# EAGLE design AudioJackIO (EAGLE 9.6.1)
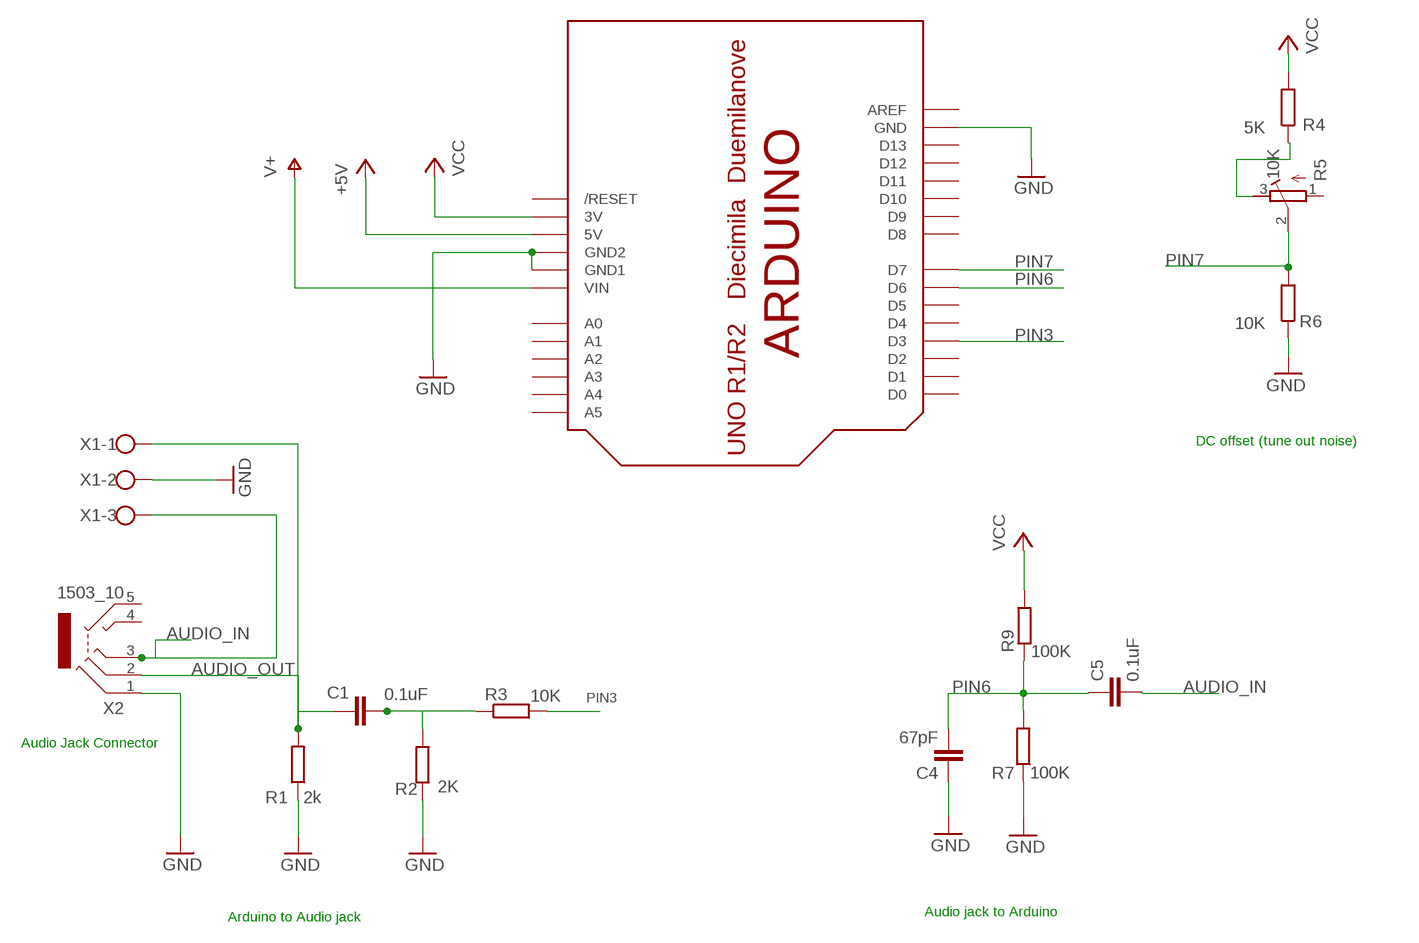
[diagram p0: schematic, sheet 1]

## Parts
C1  0.1uF  C-EU025-025X050  [C025-025X050]
C4  67pF  C-EU025-025X050  [C025-025X050]
C5  0.1uF  C-EU025-025X050  [C025-025X050]
R1  2k  R-EU_0204/7  [0204/7]
R2  2K  R-EU_0204/7  [0204/7]
R3  10K  R-EU_0204/7  [0204/7]
R4  5K  R-EU_0204/7  [0204/7]
R5  10K  R-TRIMM64Y  [RTRIM64Y]
R6  10K  R-EU_0204/7  [0204/7]
R7  100K  R-EU_0204/7  [0204/7]
R9  100K  R-EU_0204/7  [0204/7]
U$1  ARDUINO-BPLACE  [ARDUINO-BPLACE]
X1  W237-103  [W237-103]
X2  1503_10  [1503_10]

## Nets
+5V [POWER]: U$1.5V
AUDIO_IN [Signal]: C5.2 X1.3 X2.3
AUDIO_OUT [Signal]: C1.1 R1.2 X1.1 X2.2
GND [POWER]: C4.1 R1.1 R2.2 R6.1 R7.1 U$1.GND U$1.GND1 U$1.GND2 X1.2 X2.1
N$1 [Signal]: C1.2 R2.1 R3.1
N$3 [Signal]: R4.1 R5.3(E)
PIN3 [Signal]: R3.2 U$1.D3
PIN6 [Signal]: C4.2 C5.1 R7.2 R9.1 U$1.D6
PIN7 [Signal]: R5.2(S) R6.2 U$1.D7
V+ [POWER]: U$1.VIN
VCC [POWER]: R4.2 R9.2 U$1.3V
Unconnected: R5.1(A) U$1.A0 U$1.A1 U$1.A2 U$1.A3 U$1.A4 U$1.A5 U$1.AREF U$1.D0 U$1.D1 U$1.D2 U$1.D4 U$1.D5 U$1.D8 U$1.D9 U$1.D10 U$1.D11 U$1.D12 U$1.D13 U$1.RESET(/RESET) X2.4 X2.5

## Notes on the sheet
- DC offset (tune out noise)
- Audio Jack Connector
- Audio jack to Arduino
- Arduino to Audio jack

## Library data of the parts
C1 C4 C5 = rcl:C-EU: CAPACITOR, European symbol; SPICEPREFIX: C
R1-R4 R6 R7 R9 = rcl:R-EU_: RESISTOR, European symbol; SPICEPREFIX: R
R5 = rcl:R-TRIMM: Trimm resistor; SPICEMODEL: X; SPICEPREFIXL: POT
U$1 = adafruit:ARDUINO: Arduino Diecimila/Duemilanove Make a shield with ease, this package has all the named pins as well as the two mounting drill holes and an outline of the USB and DC power connector. The outline is on the DIMENSION layer, so if your board house uses it they will cut the outline to match. http://www.ladyada.net/library/pcb/eaglelibrary.html
X1 = con-wago-500:W237-103: WAGO SCREW CLAMP; MPN: 237-103; OC_FARNELL: unknown; OC_NEWARK: 18M7116
X2 = con-lumberg:1503_10: Jack connectors according to JISC 6560, 3.5 mm Klinkeneinbaukupplung, 3,5 mm, 4-polig/stereo, abgewinkelte Ausführung Source: http://www.lumberg.de/Produkte/PDFs/1503_10.pdf; OC_FARNELL: 1308868; OC_NEWARK: unknown

## Net classes
1 POWER: width 1.27 mm
2 Signal: width 0.889 mm

## Board
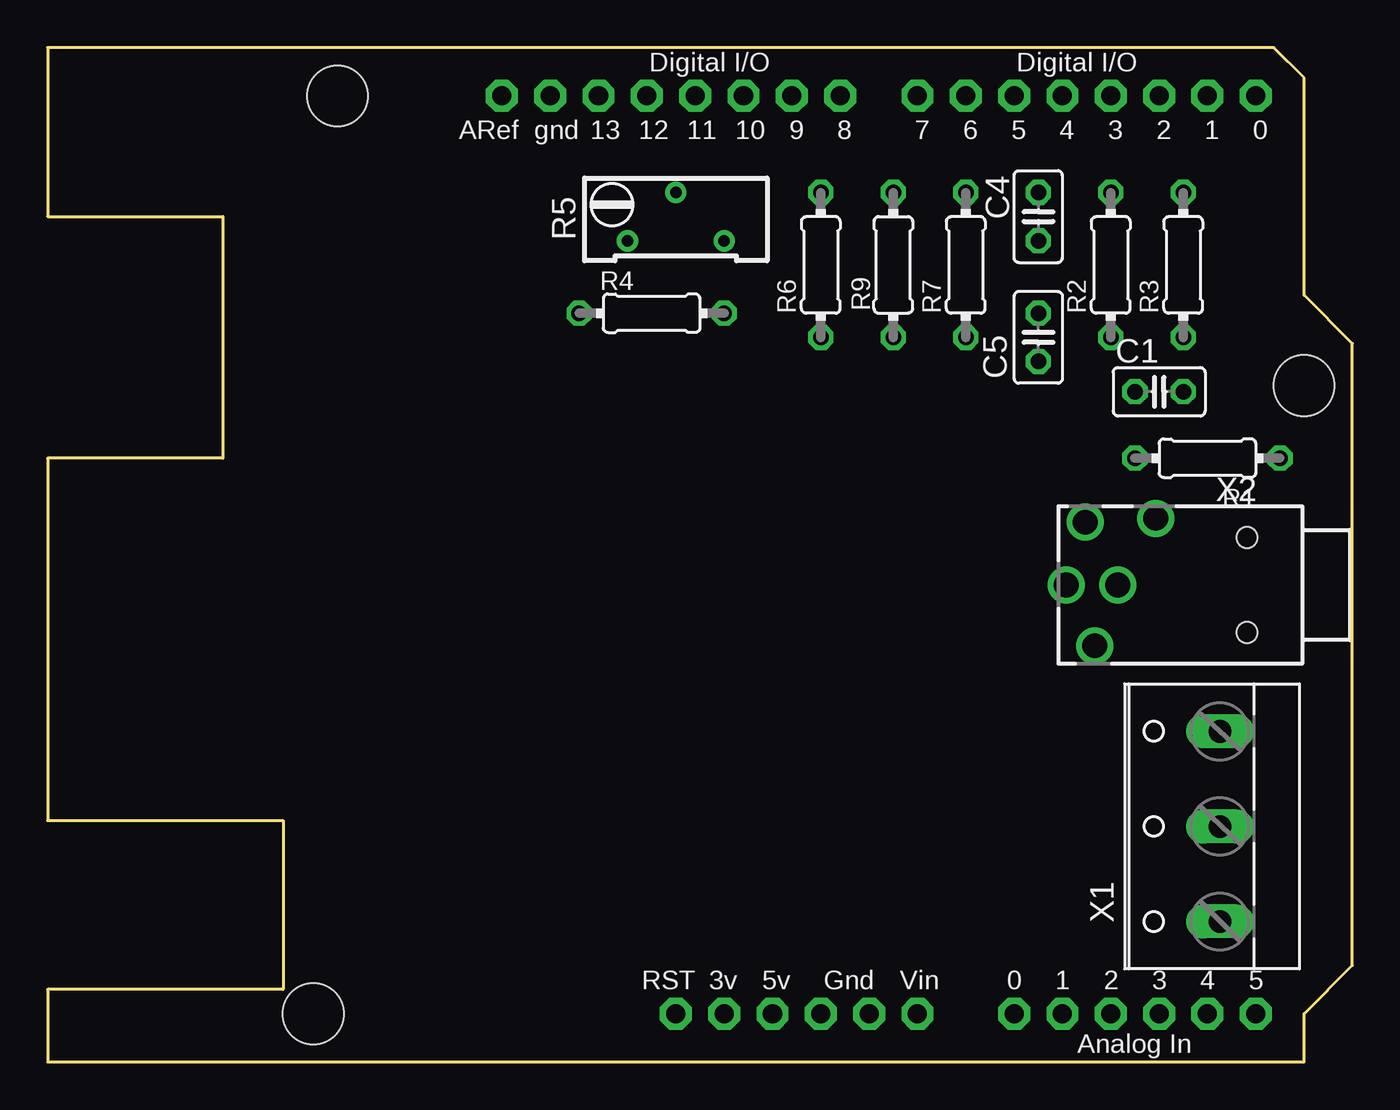
[diagram p1: board, top side]
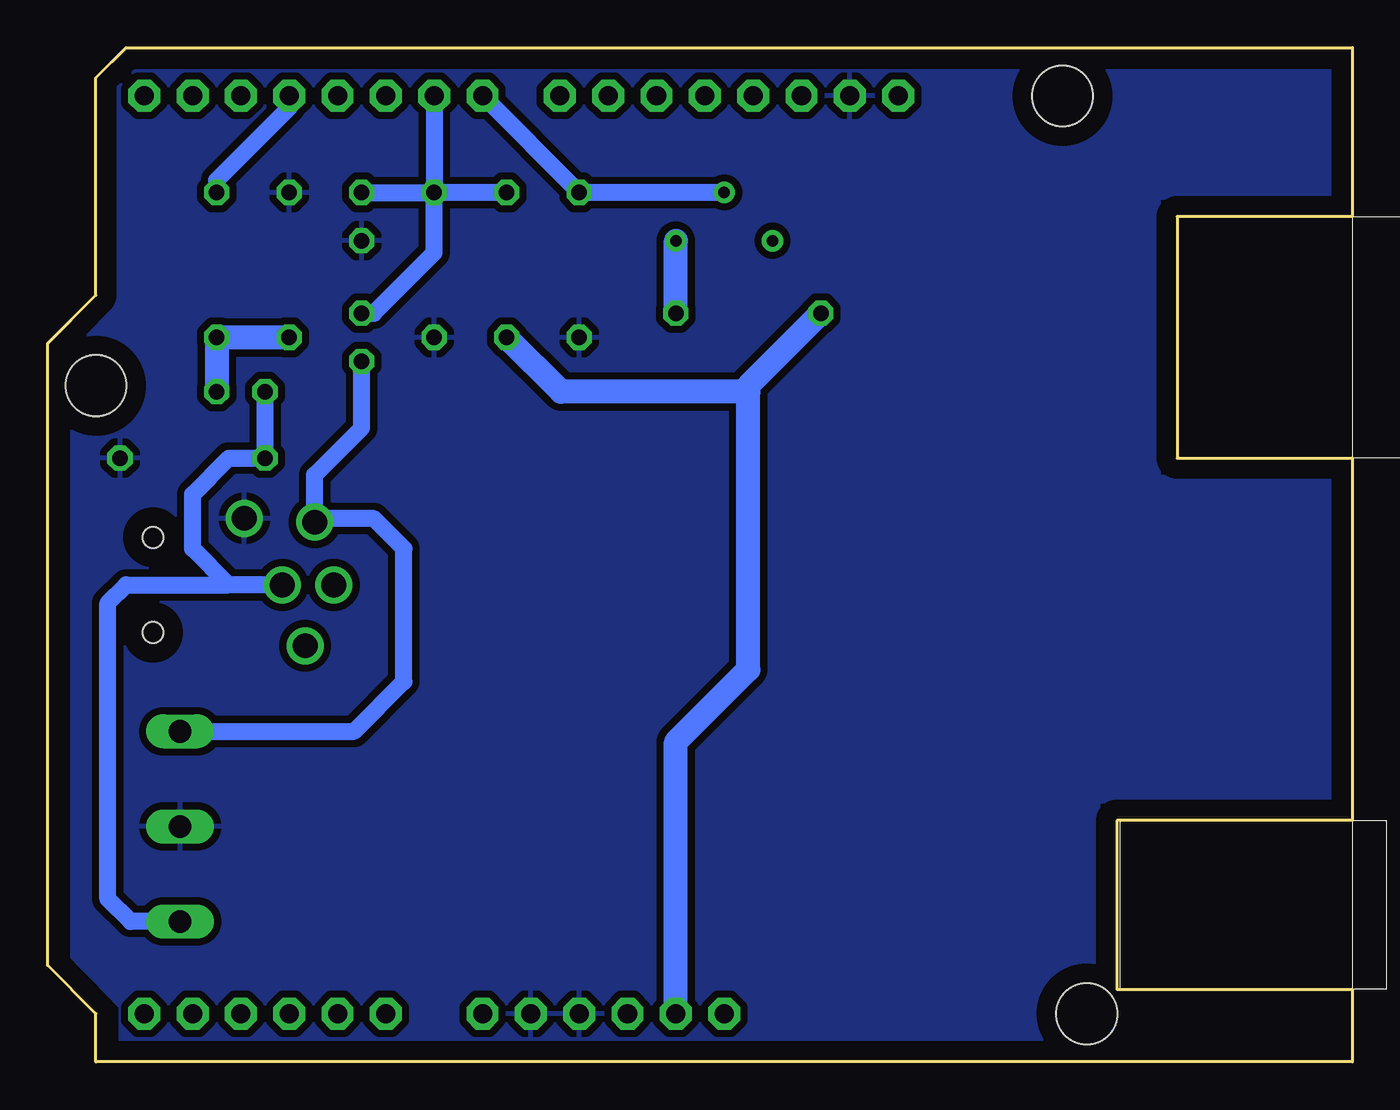
[diagram p2: board, bottom side, seen from below]

Size 68.58 x 53.34 mm. Coordinates in mm from the lower left corner, seen from the top.
Outline: 0,53.34 0,44.45 9.21,44.45 9.21,31.75 0,31.75 0,12.7 12.38,12.7 12.38,3.81 0,3.81 0,0 66.04,0 66.04,2.54 68.58,5.08 68.58,37.78 66.04,40.32 66.04,51.75 64.45,53.34 0,53.34
Copper layers (1*16): Top 0.035mm / dielectric 1.5mm / Bottom 0.035mm
Design rules "default *": minimum track width 15mil, minimum drill 0.35mm, track to track 15mil, track to pad 15mil, pad to pad 15mil, via to via 15mil, smd to smd 15mil, copper to edge 40mil, drill to drill 6mil, minimum pad ring 10mil, minimum via ring 8mil, stop-mask expansion 4mil, vias tented up to drill 0mil, thermal gap 15mil

### Footprints (pad centres in the part's own frame; a part is rotated, then mirrored left to right if it is on the bottom)
C025-025X050 = drill 0.813 octagon: 1 -1.27,0; 2 1.27,0
0204/7 = drill 0.813 octagon: 1 -3.81,0; 2 3.81,0
RTRIM64Y = drill 0.61: 1 0,-2.54; 2 -2.54,0; 3 0,2.54
ARDUINO-BPLACE = drill 1 pad 1.676 octagon: 3V 35.56,2.54; 5V 38.1,2.54; A0 50.8,2.54; A1 53.34,2.54; A2 55.88,2.54; A3 58.42,2.54; A4 60.96,2.54; A5 63.5,2.54; AREF 23.876,50.8; D0 63.5,50.8; D1 60.96,50.8; D2 58.42,50.8; D3 55.88,50.8; D4 53.34,50.8; D5 50.8,50.8; D6 48.26,50.8; D7 45.72,50.8; D8 41.656,50.8; D9 39.116,50.8; D10 36.576,50.8; D11 34.036,50.8; D12 31.496,50.8; D13 28.956,50.8; GND 26.416,50.8; GND1 43.18,2.54; GND2 40.64,2.54; RESET 33.02,2.54; VIN 45.72,2.54 | hole 3.2: 15.24,50.8; 66.04,35.56; 13.97,2.54
W237-103 = drill 1.194 long: 1 -5,-1.29; 2 0,-1.29; 3 5,-1.29
1503_10 = drill 1.3 pad 1.9: 1 -3.5,-7.8; 2 0,-9.8; 3 -3.3,-11.5; 4 3.2,-11; 5 0,-12.5 | hole 1.1: -2.5,-3; 2.5,-3

### Placement (x,y rotation side)
C1  58.42,35.24 0 top
C4  52.07,44.45 90 top
C5  52.07,38.1 270 top
R1  60.96,31.75 180 top
R2  55.88,41.91 90 top
R3  59.69,41.91 90 top
R4  31.75,39.37 180 top
R5  33.02,43.18 270 top
R6  40.64,41.91 90 top
R7  48.26,41.91 90 top
R9  44.45,41.91 270 top
U$1  0,0 0 top
X1  60.33,12.38 90 top
X2  66.04,25.08 270 top

### Tracks (layer width: path | path; a pad name or v marks a point on that pad's centre or on a via)
AUDIO_IN
  Bottom 0.889: C5.2 52.07,33.34 54.54,30.87 X2.3 54.35,28.57 51.44,28.57 49.85,26.99 49.85,20 52.47,17.38 X1.3
AUDIO_OUT
  Bottom 0.889: C1.1 R1.2 59.05,31.75 60.96,29.84 60.96,26.99 59.05,25.08 | X2.2 59.05,25.08 | X1.1 64.22,7.38 65.41,8.57 65.41,24.13 64.45,25.08 59.05,25.08
GND
  pour Bottom: 0.95,52.39 0.95,45.4 10.16,45.4 10.16,30.8 1.27,30.8 0.95,30.8 0.95,13.65 13.34,13.65 13.34,3.17 13.34,2.86 1.27,2.86 1.27,0.95 64.45,0.95 64.77,0.95 64.77,2.86 67.31,5.4 67.31,9.53 67.31,36.83 67.31,37.47 65.09,39.69 65.09,50.8 65.09,51.44 64.14,52.39 60.96,52.39
N$1
  Bottom 1.27: R2.1 R3.1 C1.2
N$3
  Bottom 1.27: R4.1 R5.3
PIN3
  Bottom 0.889: U$1.D3 55.88,50.16 59.69,46.35 R3.2
PIN6
  Bottom 0.889: R9.1 R7.2 | C4.2 R7.2 | U$1.D6 R7.2 | C5.1 51.44,39.37 48.26,42.55 R7.2
PIN7
  Bottom 0.889: R5.2 R6.2 U$1.D7
VCC
  Bottom 1.27: R4.2 31.75,35.56 31.75,35.24 | 31.75,35.24 41.59,35.24 R9.2 | U$1.3V 35.56,16.83 31.75,20.64 31.75,35.24